# Altium project IrrigationStation_V2R1.PrjPcb
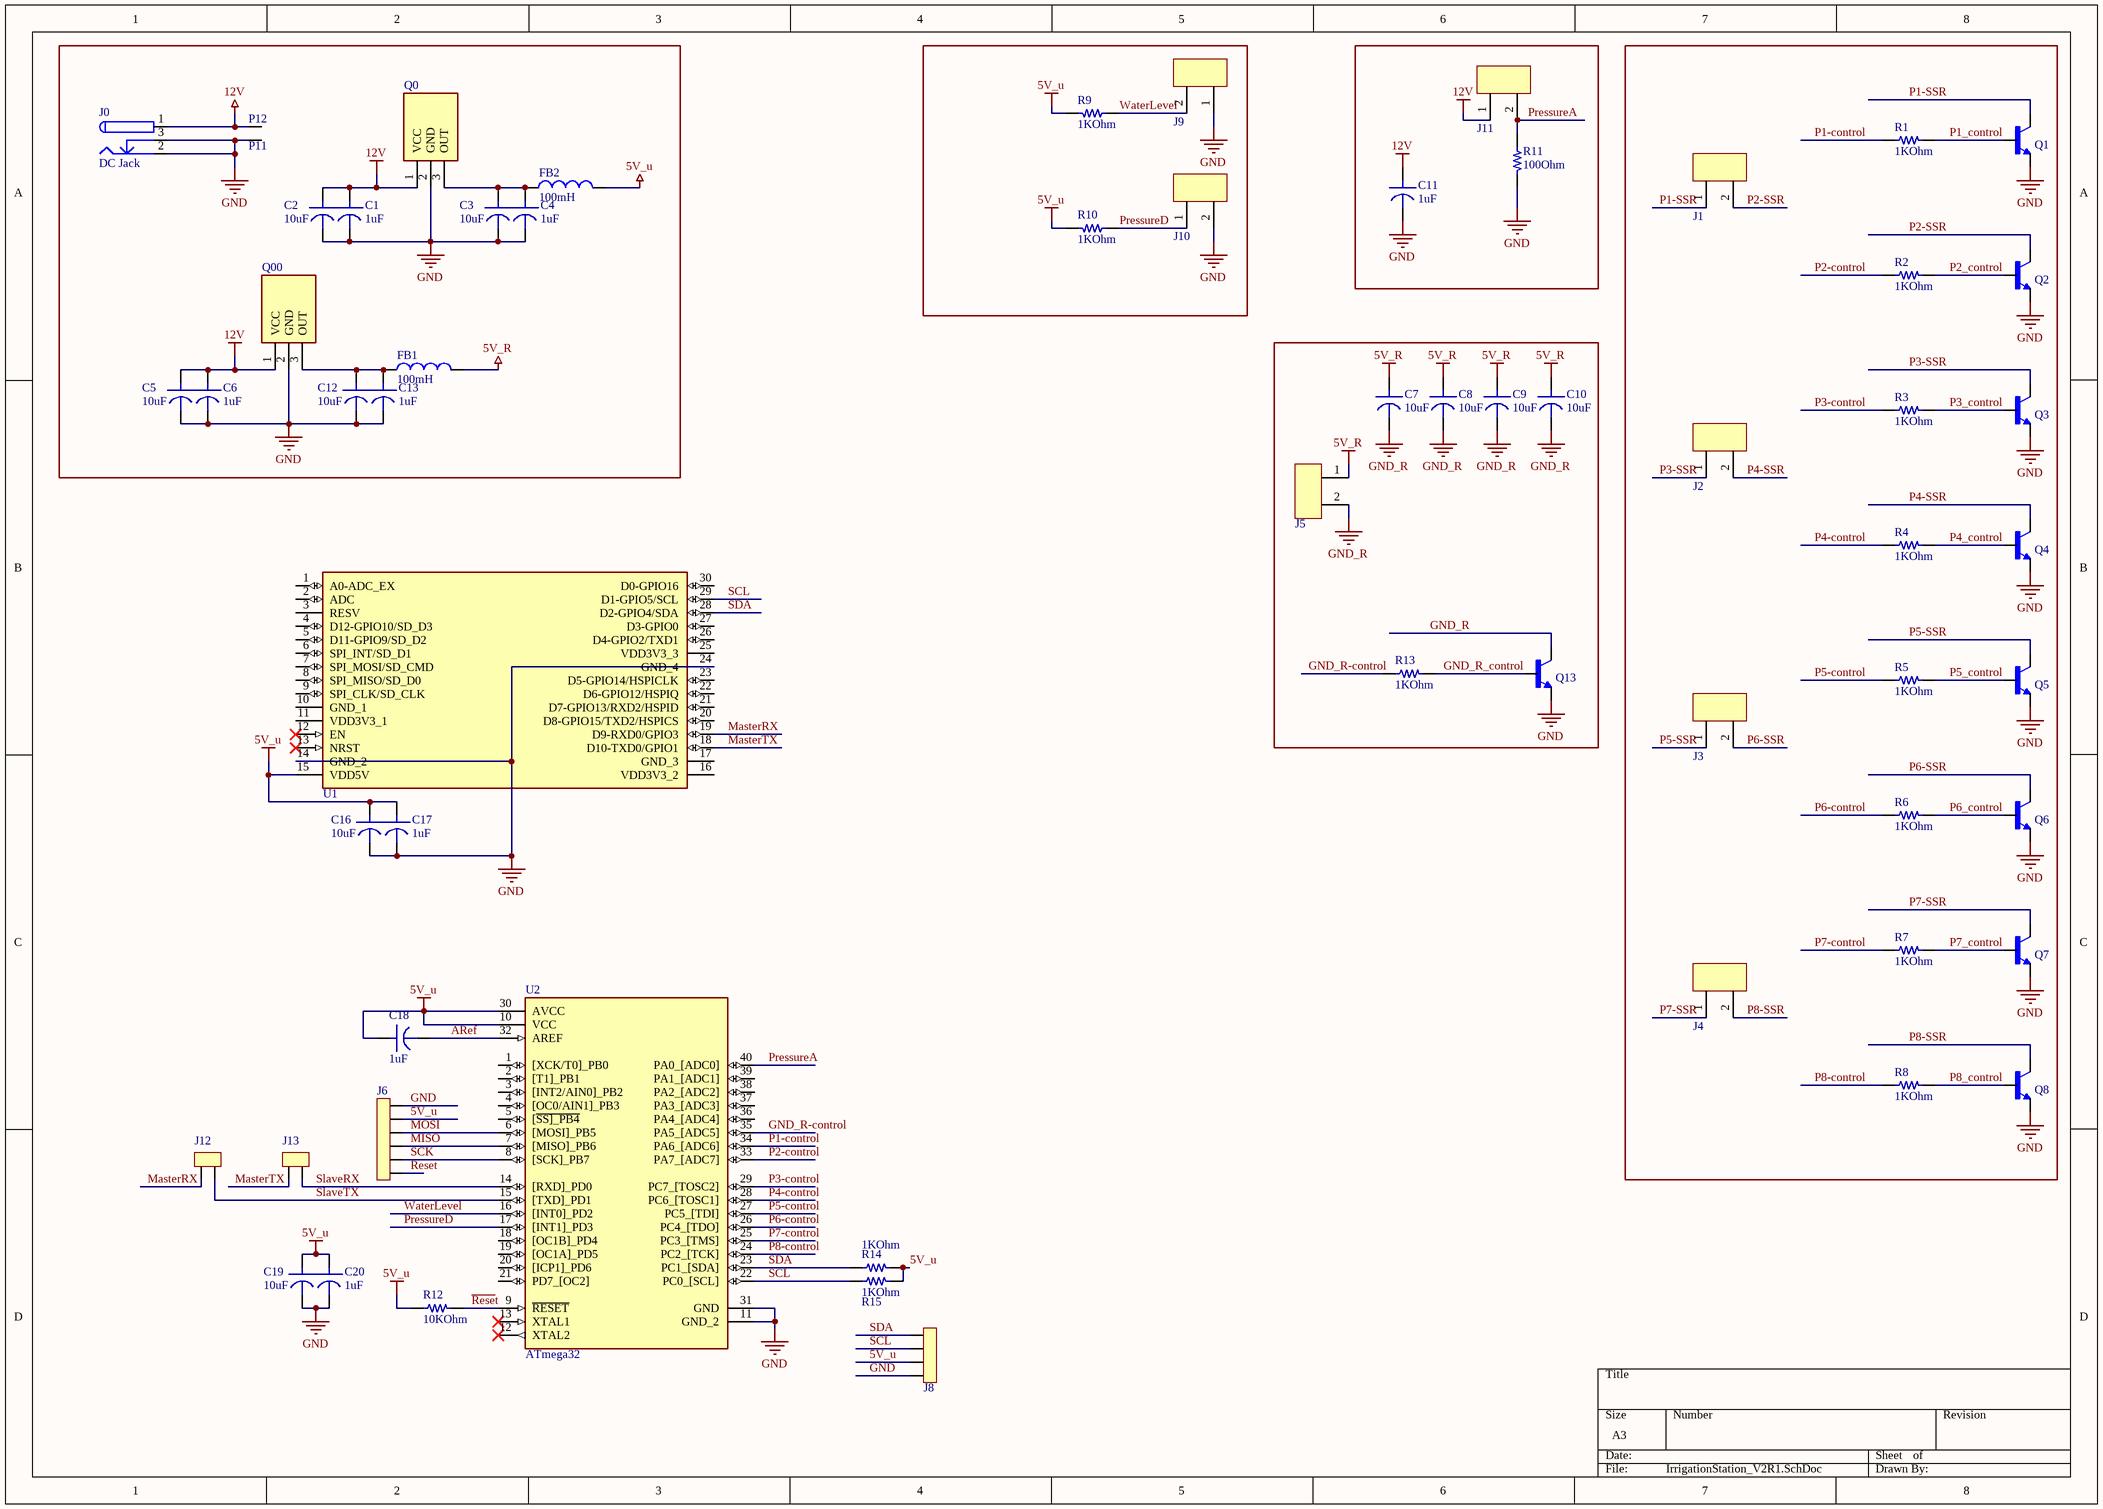
[diagram p0: IrrigationStation_V2R1.SchDoc]
1 sheet, 63 parts. Net scope: global (net labels, ports and power ports of the same name join across sheets).
Board file: IrrigationStation_V2R1.PcbDoc

## Sheet IrrigationStation_V2R1.SchDoc
size A3

### Parts
C1  value 1uF  [Capacitor - SMD - 0805 - pol]  (hidden comment: Capacitor - Polarized)
C2  value 10uF  [Capacitor - SMD - 0805 - pol]  (hidden comment: Capacitor - Polarized)
C3  value 10uF  [Capacitor - SMD - 0805 - pol]  (hidden comment: Capacitor - Polarized)
C4  value 1uF  [Capacitor - SMD - 0805 - pol]  (hidden comment: Capacitor - Polarized)
C5  value 10uF  [Capacitor - SMD - 0805 - pol]  (hidden comment: Capacitor - Polarized)
C6  value 1uF  [Capacitor - SMD - 0805 - pol]  (hidden comment: Capacitor - Polarized)
C7  value 10uF  [Capacitor - SMD - 0805 - pol]  (hidden comment: Capacitor - Polarized)
C8  value 10uF  [Capacitor - SMD - 0805 - pol]  (hidden comment: Capacitor - Polarized)
C9  value 10uF  [Capacitor - SMD - 0805 - pol]  (hidden comment: Capacitor - Polarized)
C10  value 10uF  [Capacitor - SMD - 0805 - pol]  (hidden comment: Capacitor - Polarized)
C11  value 1uF  [Capacitor - SMD - 0805 - pol]  (hidden comment: Capacitor - Polarized)
C12  value 10uF  [Capacitor - SMD - 0805 - pol]  (hidden comment: Capacitor - Polarized)
C13  value 1uF  [Capacitor - SMD - 0805 - pol]  (hidden comment: Capacitor - Polarized)
C16  value 10uF  [Capacitor - SMD - 0805 - pol]  (hidden comment: Capacitor - Polarized)
C17  value 1uF  [Capacitor - SMD - 0805 - pol]  (hidden comment: Capacitor - Polarized)
C18  value 1uF  [Capacitor - SMD - 0805 - pol]  (hidden comment: Capacitor - Polarized)
C19  value 10uF  [Capacitor - SMD - 0805 - pol]  (hidden comment: Capacitor - Polarized)
C20  value 1uF  [Capacitor - SMD - 0805 - pol]  (hidden comment: Capacitor - Polarized)
FB1  value 100mH  [Coil - SMD - 0805]  (hidden comment: Ferrite Bead)
FB2  value 100mH  [Coil - SMD - 0805]  (hidden comment: Ferrite Bead)
J0  DC Jack  [DC Jack - KLDHCX]
J1  P1/2  [Terminal Block,2 Pos, 4mm]  (value not drawn)
J2  P3/4  [Terminal Block,2 Pos, 4mm]  (value not drawn)
J3  P5/6  [Terminal Block,2 Pos, 4mm]  (value not drawn)
J4  P7/8  [Terminal Block,2 Pos, 4mm]  (value not drawn)
J5  PWR_R  [Terminal Block,2 Pos, 4mm]  (value not drawn)
J6  USB-ASP  [Header Female 6 - 2.54]  (value not drawn)
J8  I2C  [Header Female 4 - 2.54]  (value not drawn)
J9  W_Lvl  [Terminal Block,2 Pos, 4mm]  (value not drawn)
J10  PressD  [Terminal Block,2 Pos, 4mm]  (value not drawn)
J11  PressA  [Terminal Block,2 Pos, 4mm]  (value not drawn)
J12  R/T  [Header Male 2 - 2.54]  (value not drawn)
J13  T/R  [Header Male 2 - 2.54]  (value not drawn)
P11  GND  [Pin - TH 1.5mm]  (value not drawn)
P12  12V  [Pin - TH 1.5mm]  (value not drawn)
Q0  BA17805T  [TO254P480X1010X2280-3P]  (value not drawn)
Q00  BA17805T  [TO254P480X1010X2280-3P]  (value not drawn)
Q1  P2N2222A  [TO92]  (value not drawn)
Q2  P2N2222A  [TO92]  (value not drawn)
Q3  P2N2222A  [TO92]  (value not drawn)
Q4  P2N2222A  [TO92]  (value not drawn)
Q5  P2N2222A  [TO92]  (value not drawn)
Q6  P2N2222A  [TO92]  (value not drawn)
Q7  P2N2222A  [TO92]  (value not drawn)
Q8  P2N2222A  [TO92]  (value not drawn)
Q13  P2N2222A  [TO92]  (value not drawn)
R1  value 1KOhm  [Resistor - SMD - 0805]  (hidden comment: Resistor)
R2  value 1KOhm  [Resistor - SMD - 0805]  (hidden comment: Resistor)
R3  value 1KOhm  [Resistor - SMD - 0805]  (hidden comment: Resistor)
R4  value 1KOhm  [Resistor - SMD - 0805]  (hidden comment: Resistor)
R5  value 1KOhm  [Resistor - SMD - 0805]  (hidden comment: Resistor)
R6  value 1KOhm  [Resistor - SMD - 0805]  (hidden comment: Resistor)
R7  value 1KOhm  [Resistor - SMD - 0805]  (hidden comment: Resistor)
R8  value 1KOhm  [Resistor - SMD - 0805]  (hidden comment: Resistor)
R9  value 1KOhm  [Resistor - TH - 12mm]  (hidden comment: Resistor)
R10  value 1KOhm  [Resistor - TH - 12mm]  (hidden comment: Resistor)
R11  value 100Ohm  [Resistor - SMD - 0805]  (hidden comment: Resistor)
R12  value 10KOhm  [Resistor - SMD - 0805]  (hidden comment: Resistor)
R13  value 1KOhm  [Resistor - TH - 12mm]  (hidden comment: Resistor)
R14  value 1KOhm  [Resistor - SMD - 0805]  (hidden comment: Resistor)
R15  value 1KOhm  [Resistor - SMD - 0805]  (hidden comment: Resistor)
U1  NodeMcu  [DIP2286W64P254L4826H735Q30N]  (value not drawn)
U2  ATmega32  [DIP1556W56P254L5232H483Q40N]

### Nets
5V_R: C7.1 C8.1 C9.1 C10.1 FB1.1 J5.1
5V_u: C16.1 C17.1 C18.1 C19.1 C20.1 FB2.1 J6.2 J8.3 R9.2 R10.2 R12.1 R14.2 R15.2 U1.15(VDD5V) U2.10(VCC) U2.30(AVCC)
12V: C1.1 C2.1 C5.1 C6.1 C11.1 J0.1 J11.1 P12.1 Q0.1(VCC) Q00.1(VCC)
GND: C1.2 C2.2 C3.2 C4.2 C5.2 C6.2 C11.2 C12.2 C13.2 C16.2 C17.2 C19.2 C20.2 J0.2 J0.3 J6.1 J8.4 J9.1 J10.2 P11.1 Q0.2(GND) Q00.2(GND) Q1.1(E) Q2.1(E) Q3.1(E) Q4.1(E) Q5.1(E) Q6.1(E) Q7.1(E) Q8.1(E) Q13.1(E) R11.2 U1.14(GND_2) U1.24(GND_4) U2.11(GND_2) U2.31(GND)
GND_R: C7.2 C8.2 C9.2 C10.2 J5.2 Q13.3(C)
~{Rese}t: J6.6 R12.2 U2.9(~{RESET})
ARef: C18.2 U2.32(AREF)
GND_R-control: R13.1 U2.35(PA5_[ADC5])
GND_R_control: Q13.2(B) R13.2
MasterRX: J12.2 U1.19(D9-RXD0/GPIO3)
MasterTX: J13.2 U1.18(D10-TXD0/GPIO1)
MISO: J6.4 U2.7([MISO]_PB6)
MOSI: J6.3 U2.6([MOSI]_PB5)
P1-control: R1.1 U2.34(PA6_[ADC6])
P1-SSR: J1.1 Q1.3(C)
P1_control: Q1.2(B) R1.2
P2-control: R2.1 U2.33(PA7_[ADC7])
P2-SSR: J1.2 Q2.3(C)
P2_control: Q2.2(B) R2.2
P3-control: R3.1 U2.29(PC7_[TOSC2])
P3-SSR: J2.1 Q3.3(C)
P3_control: Q3.2(B) R3.2
P4-control: R4.1 U2.28(PC6_[TOSC1])
P4-SSR: J2.2 Q4.3(C)
P4_control: Q4.2(B) R4.2
P5-control: R5.1 U2.27(PC5_[TDI])
P5-SSR: J3.1 Q5.3(C)
P5_control: Q5.2(B) R5.2
P6-control: R6.1 U2.26(PC4_[TDO])
P6-SSR: J3.2 Q6.3(C)
P6_control: Q6.2(B) R6.2
P7-control: R7.1 U2.25(PC3_[TMS])
P7-SSR: J4.1 Q7.3(C)
P7_control: Q7.2(B) R7.2
P8-control: R8.1 U2.24(PC2_[TCK])
P8-SSR: J4.2 Q8.3(C)
P8_control: Q8.2(B) R8.2
PressureA: J11.2 R11.1 U2.40(PA0_[ADC0])
PressureD: J10.1 R10.1 U2.17([INT1]_PD3)
SCK: J6.5 U2.8([SCK]_PB7)
SCL: J8.2 R15.1 U1.29(D1-GPIO5/SCL) U2.22(PC0_[SCL])
SDA: J8.1 R14.1 U1.28(D2-GPIO4/SDA) U2.23(PC1_[SDA])
SlaveRX: J13.1 U2.14([RXD]_PD0)
SlaveTX: J12.1 U2.15([TXD]_PD1)
WaterLevel: J9.2 R9.1 U2.16([INT0]_PD2)
NetC3_1: C3.1 C4.1 FB2.2 Q0.3(OUT)
NetC12_1: C12.1 C13.1 FB1.2 Q00.3(OUT)

Not connected (* = marked no-connect by the designer): U1 1(A0-ADC_EX) 2(ADC) 3(RESV) 4(D12-GPIO10/SD_D3) 5(D11-GPIO9/SD_D2) 6(SPI_INT/SD_D1) 7(SPI_MOSI/SD_CMD) 8(SPI_MISO/SD_D0) 9(SPI_CLK/SD_CLK) 10(GND_1) 11(VDD3V3_1) 12(EN)* 13(NRST)* 16(VDD3V3_2) 17(GND_3) 20(D8-GPIO15/TXD2/HSPICS) 21(D7-GPIO13/RXD2/HSPID) 22(D6-GPIO12/HSPIQ) 23(D5-GPIO14/HSPICLK) 25(VDD3V3_3) 26(D4-GPIO2/TXD1) 27(D3-GPIO0) 30(D0-GPIO16); U2 1([XCK/T0]_PB0) 2([T1]_PB1) 3([INT2/AIN0]_PB2) 4([OC0/AIN1]_PB3) 5([~{SS]_PB4}) 12(XTAL2)* 13(XTAL1)* 18([OC1B]_PD4) 19([OC1A]_PD5) 20([ICP1]_PD6) 21(PD7_[OC2]) 36(PA4_[ADC4]) 37(PA3_[ADC3]) 38(PA2_[ADC2]) 39(PA1_[ADC1])

### Library data of the parts
C1-C13 C16-C20 = Capacitor - Polarized: Generic Polarized Capacitor
FB1 FB2 = Ferrite Bead: Generic Ferrite Bead
J1-J5 J9-J11 = TERM BLOCK PLUG 2POS: 2 Position Terminal Block Plug, Female Sockets 180° Free Hanging (In-Line)
J6 = Header 6: Header - 6 pins
J8 = Header 4: Header - 4 pins
J12 J13 = Header 2: Header - 2 pins
P11 P12 = Pin: Single Pin
Q0 Q00 = BA17805T: Voltage Regulator; Value: 7805
Q1-Q8 Q13 = P2N2222A: Transitor - BJT - NPN 40V 600mA 300 MHz 625mW - TO-92-3; Value: 2N222
R1-R15 = Resistor: Generic Resistor
U1 = NodeMcu: ESP32 NodeMCU
U2 = ATMEGA32-16PU: AVR ATmega Microcontroller IC 8-Bit 16MHz 32KB _16K x 16_ FLASH 40-PDIP